# Altium schematic sheet VISUR-SB.SchDoc
size 420 x 297 mm
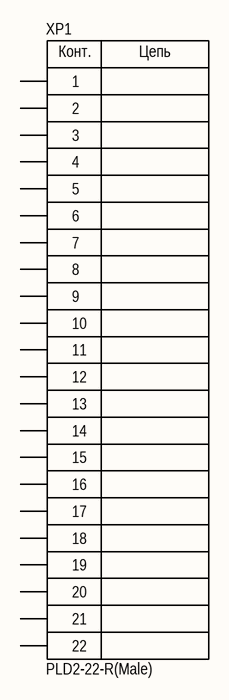
[diagram p0: VISUR-SB.SchDoc]

## Parts
XP1  PLD2-22-R(Male)  [CON: PLD2-22-R(Male)]

## Nets

Not connected (* = marked no-connect by the designer): XP1 1 2 3 4 5 6 7 8 9 10 11 12 13 14 15 16 17 18 19 20 21 22

## Notes on the sheet
- Перв. примен.
- Справ. №
- Подп. и дата
- Инв. № дубл.
- Взам. инв. №
- Разраб.
- Изм.
- Лист
- № докум.
- Подп.
- Дата
- Лит.
- Масса
- Масштаб
- Пров.
- Т.контр.
- Листов
- Инв. № подл.
- Утв.
- Н.контр.
- 2.106-A3
- Копировал
- Формат А3
- (in symbol PLD2-22-R(Male)) Конт.; Цепь

## Library data of the parts
XP1 = PLD2-22-R(Male): ComponentLink1Description: Datasheet; ComponentLink1URL: https://www.compel.ru/item-pdf/1e1366ded138976aeb89dd182fa987b9/ps/kls~kls1-207b.pdf